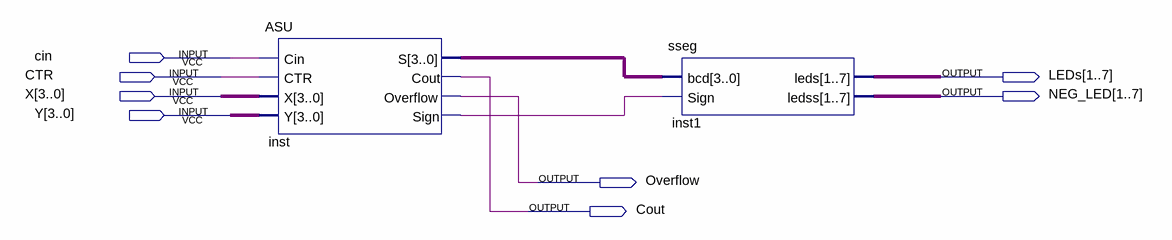
[diagram p0: schematic sheet]
// Quartus schematic partA.bdf as structural Verilog: 2 symbols, 8 pins
module partA (
  input  cin,
  input  CTR,
  input  [3:0] X,
  input  [3:0] Y,
  output [1:7] LEDs,
  output [1:7] NEG_LED,
  output Overflow,
  output Cout
);

  wire inst_sign;
  wire [3:0] inst_s;

  ASU inst (.Cin(cin), .CTR(CTR), .X(X), .Y(Y), .S(inst_s), .Cout(Cout), .Overflow(Overflow), .Sign(inst_sign));
  sseg inst1 (.bcd(inst_s), .Sign(inst_sign), .leds(LEDs), .ledss(NEG_LED));
endmodule
